# EAGLE design control_board (EAGLE 6.6.0)
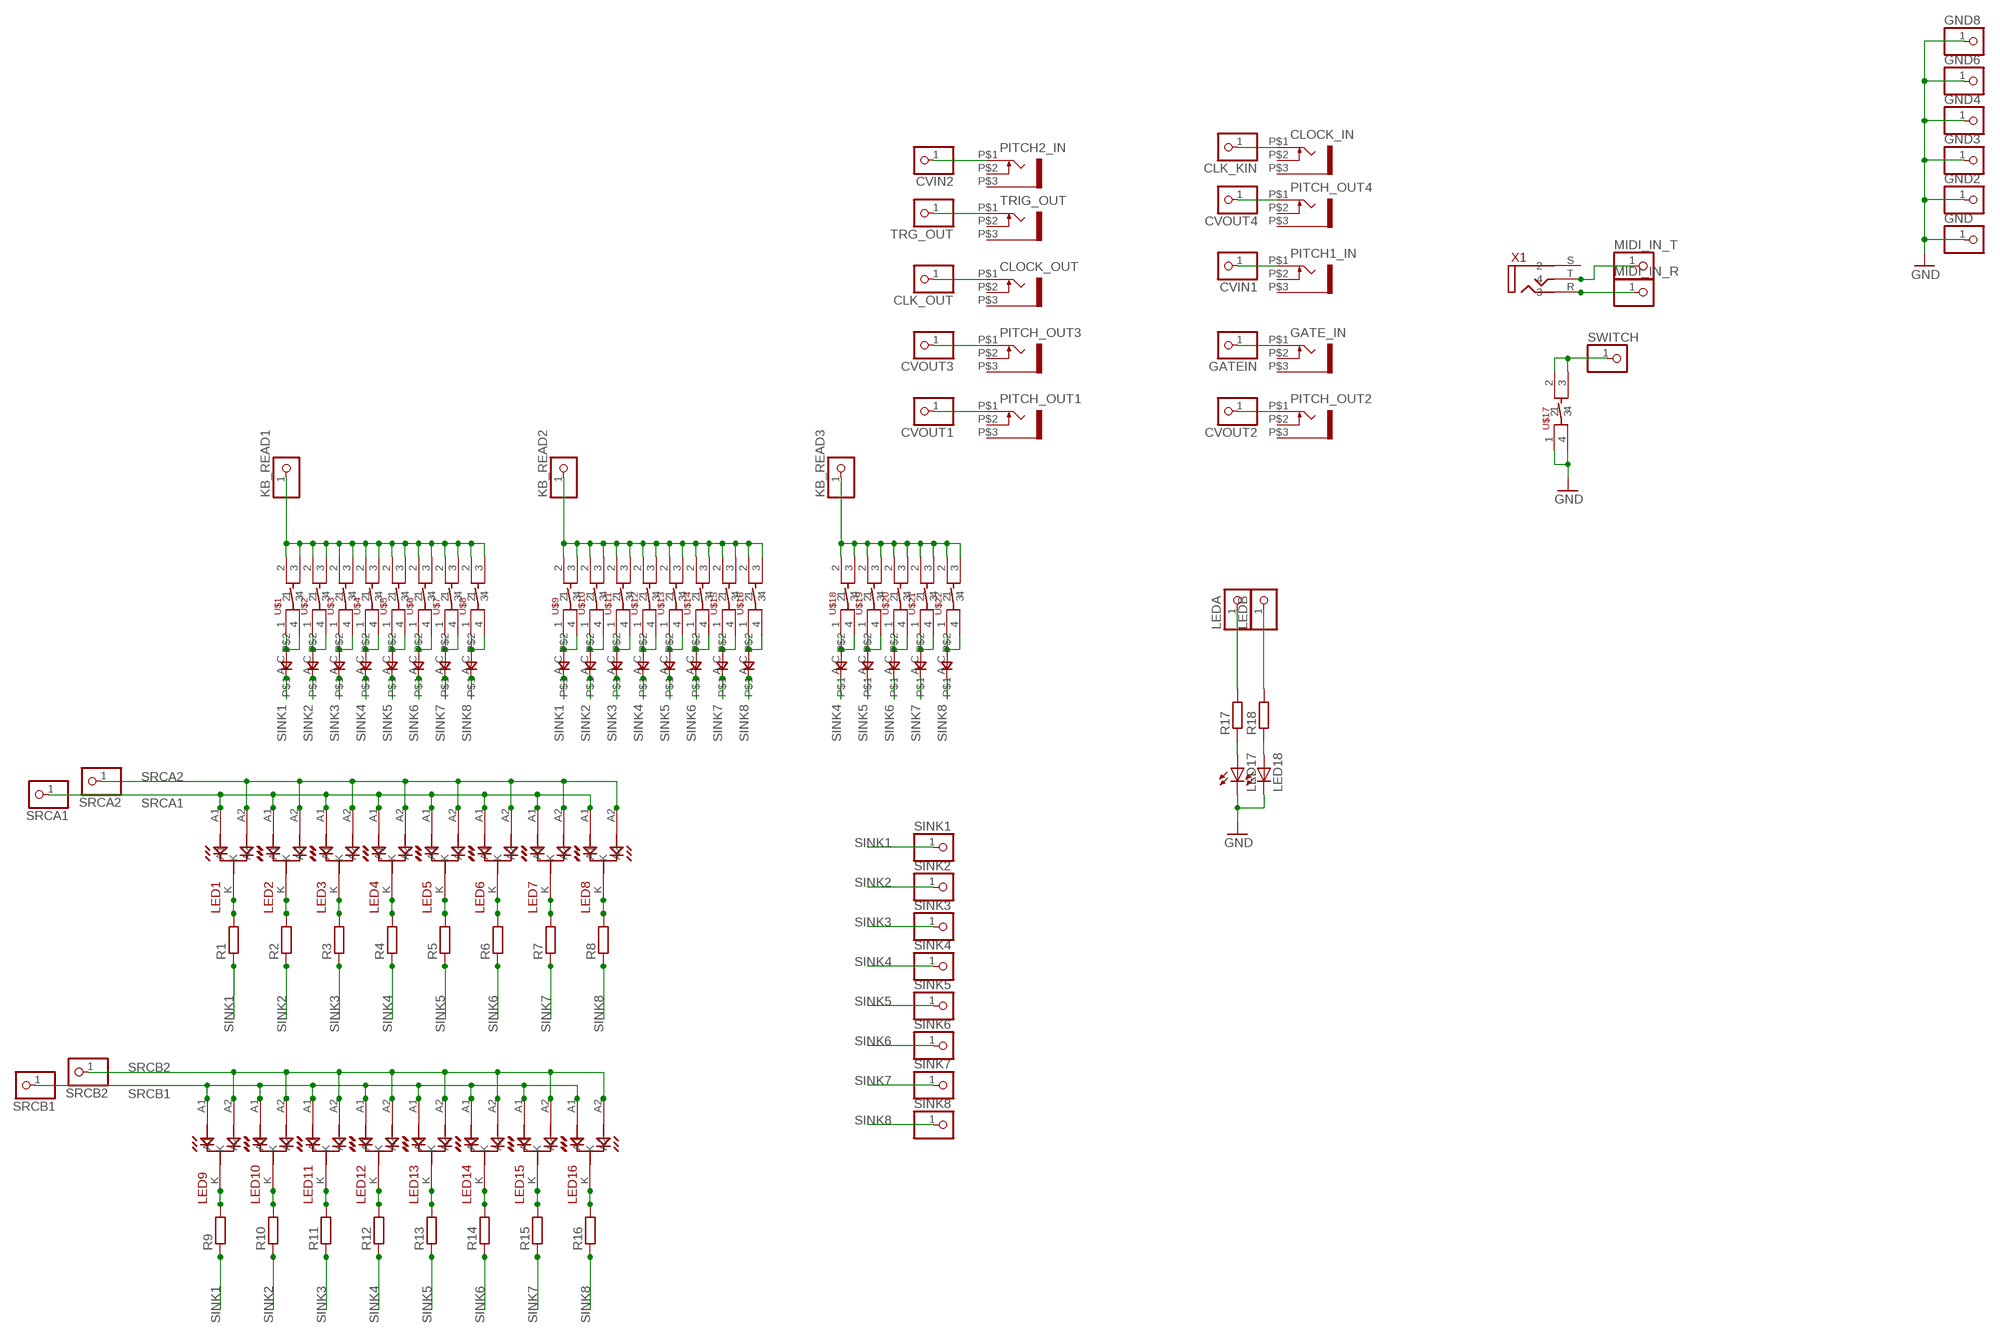
[diagram p0: schematic, sheet 1]

## Parts
CLK_KIN  PINHD-1X1  [1X01]
CLK_OUT  PINHD-1X1  [1X01]
CLOCK_IN  WQP-PJ301M-12_JACK  [WQP-PJ301M-12_JACK]
CLOCK_OUT  WQP-PJ301M-12_JACK  [WQP-PJ301M-12_JACK]
CVIN1  PINHD-1X1  [1X01]
CVIN2  PINHD-1X1  [1X01]
CVOUT1  PINHD-1X1  [1X01]
CVOUT2  PINHD-1X1  [1X01]
CVOUT3  PINHD-1X1  [1X01]
CVOUT4  PINHD-1X1  [1X01]
GATE_IN  WQP-PJ301M-12_JACK  [WQP-PJ301M-12_JACK]
GATEIN  PINHD-1X1  [1X01]
GND  PINHD-1X1  [1X01]
GND2  PINHD-1X1  [1X01]
GND3  PINHD-1X1  [1X01]
GND4  PINHD-1X1  [1X01]
GND6  PINHD-1X1  [1X01]
GND8  PINHD-1X1  [1X01]
KB_READ1  PINHD-1X1  [1X01]
KB_READ2  PINHD-1X1  [1X01]
KB_READ3  PINHD-1X1  [1X01]
LED1  BICOL_LED_CC  [BICOL_LED_CC]
LED2  BICOL_LED_CC  [BICOL_LED_CC]
LED3  BICOL_LED_CC  [BICOL_LED_CC]
LED4  BICOL_LED_CC  [BICOL_LED_CC]
LED5  BICOL_LED_CC  [BICOL_LED_CC]
LED6  BICOL_LED_CC  [BICOL_LED_CC]
LED7  BICOL_LED_CC  [BICOL_LED_CC]
LED8  BICOL_LED_CC  [BICOL_LED_CC]
LED9  BICOL_LED_CC  [BICOL_LED_CC]
LED10  BICOL_LED_CC  [BICOL_LED_CC]
LED11  BICOL_LED_CC  [BICOL_LED_CC]
LED12  BICOL_LED_CC  [BICOL_LED_CC]
LED13  BICOL_LED_CC  [BICOL_LED_CC]
LED14  BICOL_LED_CC  [BICOL_LED_CC]
LED15  BICOL_LED_CC  [BICOL_LED_CC]
LED16  BICOL_LED_CC  [BICOL_LED_CC]
LED17  LED3MM  [LED3MM]
LED18  LED3MM  [LED3MM]
LEDA  PINHD-1X1  [1X01]
LEDB  PINHD-1X1  [1X01]
MIDI_IN_R  PINHD-1X1  [1X01]
MIDI_IN_T  PINHD-1X1  [1X01]
PITCH1_IN  WQP-PJ301M-12_JACK  [WQP-PJ301M-12_JACK]
PITCH2_IN  WQP-PJ301M-12_JACK  [WQP-PJ301M-12_JACK]
PITCH_OUT1  WQP-PJ301M-12_JACK  [WQP-PJ301M-12_JACK]
PITCH_OUT2  WQP-PJ301M-12_JACK  [WQP-PJ301M-12_JACK]
PITCH_OUT3  WQP-PJ301M-12_JACK  [WQP-PJ301M-12_JACK]
PITCH_OUT4  WQP-PJ301M-12_JACK  [WQP-PJ301M-12_JACK]
R1  R-EU_R0805  [R0805]
R2  R-EU_R0805  [R0805]
R3  R-EU_R0805  [R0805]
R4  R-EU_R0805  [R0805]
R5  R-EU_R0805  [R0805]
R6  R-EU_R0805  [R0805]
R7  R-EU_R0805  [R0805]
R8  R-EU_R0805  [R0805]
R9  R-EU_R0805  [R0805]
R10  R-EU_R0805  [R0805]
R11  R-EU_R0805  [R0805]
R12  R-EU_R0805  [R0805]
R13  R-EU_R0805  [R0805]
R14  R-EU_R0805  [R0805]
R15  R-EU_R0805  [R0805]
R16  R-EU_R0805  [R0805]
R17  R-EU_R0805  [R0805]
R18  R-EU_R0805  [R0805]
SINK1  PINHD-1X1  [1X01]
SINK2  PINHD-1X1  [1X01]
SINK3  PINHD-1X1  [1X01]
SINK4  PINHD-1X1  [1X01]
SINK5  PINHD-1X1  [1X01]
SINK6  PINHD-1X1  [1X01]
SINK7  PINHD-1X1  [1X01]
SINK8  PINHD-1X1  [1X01]
SRCA1  PINHD-1X1  [1X01]
SRCA2  PINHD-1X1  [1X01]
SRCB1  PINHD-1X1  [1X01]
SRCB2  PINHD-1X1  [1X01]
SWITCH  PINHD-1X1  [1X01]
TRG_OUT  PINHD-1X1  [1X01]
TRIG_OUT  WQP-PJ301M-12_JACK  [WQP-PJ301M-12_JACK]
U$1  6MM_TACT  [6MMTACT]
U$2  6MM_TACT  [6MMTACT]
U$3  6MM_TACT  [6MMTACT]
U$4  6MM_TACT  [6MMTACT]
U$5  6MM_TACT  [6MMTACT]
U$6  6MM_TACT  [6MMTACT]
U$7  6MM_TACT  [6MMTACT]
U$8  6MM_TACT  [6MMTACT]
U$9  6MM_TACT  [6MMTACT]
U$10  6MM_TACT  [6MMTACT]
U$11  6MM_TACT  [6MMTACT]
U$12  6MM_TACT  [6MMTACT]
U$13  6MM_TACT  [6MMTACT]
U$14  6MM_TACT  [6MMTACT]
U$15  6MM_TACT  [6MMTACT]
U$16  6MM_TACT  [6MMTACT]
U$17  6MM_TACT  [6MMTACT]
U$18  6MM_TACT  [6MMTACT]
U$19  6MM_TACT  [6MMTACT]
U$20  6MM_TACT  [6MMTACT]
U$21  6MM_TACT  [6MMTACT]
U$22  6MM_TACT  [6MMTACT]
U$23  0805DIODE  [0805DIODE]
U$24  0805DIODE  [0805DIODE]
U$25  0805DIODE  [0805DIODE]
U$26  0805DIODE  [0805DIODE]
U$27  0805DIODE  [0805DIODE]
U$28  0805DIODE  [0805DIODE]
U$29  0805DIODE  [0805DIODE]
U$30  0805DIODE  [0805DIODE]
U$31  0805DIODE  [0805DIODE]
U$32  0805DIODE  [0805DIODE]
U$33  0805DIODE  [0805DIODE]
U$34  0805DIODE  [0805DIODE]
U$35  0805DIODE  [0805DIODE]
U$36  0805DIODE  [0805DIODE]
U$37  0805DIODE  [0805DIODE]
U$38  0805DIODE  [0805DIODE]
U$39  0805DIODE  [0805DIODE]
U$40  0805DIODE  [0805DIODE]
U$41  0805DIODE  [0805DIODE]
U$42  0805DIODE  [0805DIODE]
U$43  0805DIODE  [0805DIODE]
X1  VERTICAL_3_5MM_SOCKETTHONK  [PJ301CM]

## Nets
GND: GND2.1 GND3.1 GND4.1 GND6.1 GND8.1 GND.1 LED17.K(C) LED18.K(C) U$17.1 U$17.4
KB_READ: KB_READ2.1 U$9.2 U$9.3 U$10.2 U$10.3 U$11.2 U$11.3 U$12.2 U$12.3 U$13.2 U$13.3 U$14.2 U$14.3 U$15.2 U$15.3 U$16.2 U$16.3
LED2: LED2.K R2.2
LEDA: LEDA.1 R17.2
N$1: U$9.1 U$9.4 U$31.C
N$2: KB_READ1.1 U$1.2 U$1.3 U$2.2 U$2.3 U$3.2 U$3.3 U$4.2 U$4.3 U$5.2 U$5.3 U$6.2 U$6.3 U$7.2 U$7.3 U$8.2 U$8.3
N$3: U$10.1 U$10.4 U$32.C
N$4: U$1.1 U$1.4 U$23.C
N$5: U$2.1 U$2.4 U$24.C
N$6: U$3.1 U$3.4 U$25.C
N$7: U$4.1 U$4.4 U$26.C
N$8: U$5.1 U$5.4 U$27.C
N$9: U$18.1 U$18.4 U$39.C
N$10: U$19.1 U$19.4 U$40.C
N$11: U$20.1 U$20.4 U$41.C
N$12: KB_READ3.1 U$18.2 U$18.3 U$19.2 U$19.3 U$20.2 U$20.3 U$21.2 U$21.3 U$22.2 U$22.3
N$13: U$6.1 U$6.4 U$28.C
N$14: U$11.1 U$11.4 U$33.C
N$15: U$12.1 U$12.4 U$34.C
N$16: U$13.1 U$13.4 U$35.C
N$17: LED1.K R1.2
N$18: U$14.1 U$14.4 U$36.C
N$19: LED17.A R17.1
N$20: LED3.K R3.2
N$21: LED4.K R4.2
N$22: LED5.K R5.2
N$23: LED6.K R6.2
N$24: LED7.K R7.2
N$25: LED8.K R8.2
N$26: U$16.1 U$16.4 U$38.C
N$27: LED9.K R9.2
N$28: U$15.1 U$15.4 U$37.C
N$29: LED10.K R10.2
N$30: LED11.K R11.2
N$31: LED12.K R12.2
N$32: LED13.K R13.2
N$33: LED14.K R14.2
N$34: LED15.K R15.2
N$35: LED16.K R16.2
N$36: LED18.A R18.1
N$38: MIDI_IN_R.1 X1.R
N$40: U$8.1 U$8.4 U$30.C
N$42: U$7.1 U$7.4 U$29.C
N$48: LEDB.1 R18.2
N$71: U$22.1 U$22.4 U$43.C
N$72: U$21.1 U$21.4 U$42.C
N$76: SWITCH.1 U$17.2 U$17.3
N$77: MIDI_IN_T.1 X1.T
N$78: CVIN2.1 PITCH2_IN.P$1
N$79: TRG_OUT.1 TRIG_OUT.P$1
N$80: CLK_OUT.1 CLOCK_OUT.P$1
N$81: CVOUT3.1 PITCH_OUT3.P$1
N$82: CVOUT1.1 PITCH_OUT1.P$1
N$83: CLK_KIN.1 CLOCK_IN.P$1
N$84: CVOUT4.1 PITCH_OUT4.P$1
N$85: CVIN1.1 PITCH1_IN.P$1
N$86: GATE_IN.P$1 GATEIN.1
N$87: CVOUT2.1 PITCH_OUT2.P$1
SINK1: R1.1 R9.1 SINK1.1 U$23.A U$31.A
SINK2: R2.1 R10.1 SINK2.1 U$24.A U$32.A
SINK3: R3.1 R11.1 SINK3.1 U$25.A U$33.A
SINK4: R4.1 R12.1 SINK4.1 U$26.A U$34.A U$39.A
SINK5: R5.1 R13.1 SINK5.1 U$27.A U$35.A U$40.A
SINK6: R6.1 R14.1 SINK6.1 U$28.A U$36.A U$41.A
SINK7: R7.1 R15.1 SINK7.1 U$29.A U$37.A U$42.A
SINK8: R8.1 R16.1 SINK8.1 U$30.A U$38.A U$43.A
SRCA1: LED1.A1 LED2.A1 LED3.A1 LED4.A1 LED5.A1 LED6.A1 LED7.A1 LED8.A1 SRCA1.1
SRCA2: LED1.A2 LED2.A2 LED3.A2 LED4.A2 LED5.A2 LED6.A2 LED7.A2 LED8.A2 SRCA2.1
SRCB1: LED9.A1 LED10.A1 LED11.A1 LED12.A1 LED13.A1 LED14.A1 LED15.A1 LED16.A1 SRCB1.1
SRCB2: LED9.A2 LED10.A2 LED11.A2 LED12.A2 LED13.A2 LED14.A2 LED15.A2 LED16.A2 SRCB2.1
Unconnected: CLOCK_IN.P$2 CLOCK_IN.P$3 CLOCK_OUT.P$2 CLOCK_OUT.P$3 GATE_IN.P$2 GATE_IN.P$3 PITCH1_IN.P$2 PITCH1_IN.P$3 PITCH2_IN.P$2 PITCH2_IN.P$3 PITCH_OUT1.P$2 PITCH_OUT1.P$3 PITCH_OUT2.P$2 PITCH_OUT2.P$3 PITCH_OUT3.P$2 PITCH_OUT3.P$3 PITCH_OUT4.P$2 PITCH_OUT4.P$3 TRIG_OUT.P$2 TRIG_OUT.P$3 X1.S

## Library data of the parts
CLK_KIN CLK_OUT CVIN1 CVIN2 CVOUT1-CVOUT4 GATEIN GND GND2-GND4 GND6 GND8 KB_READ1-KB_READ3 LEDA LEDB MIDI_IN_R MIDI_IN_T SINK1-SINK8 SRCA1 SRCA2 SRCB1 SRCB2 SWITCH TRG_OUT = pinhead:PINHD-1X1: PIN HEADER
CLOCK_IN CLOCK_OUT GATE_IN PITCH1_IN PITCH2_IN PITCH_OUT1-PITCH_OUT4 TRIG_OUT = thonkiconn:WQP-PJ301M-12_JACK
LED1-LED16 = jason_eagle6:BICOL_LED_CC
LED17 LED18 = SparkFun:LED: LEDs Standard schematic elements and footprints for 5mm, 3mm, 1206, and 0603 sized LEDs. 5mm - Spark Fun Electronics SKU : COM-00529 (and others)
R1-R18 = rcl:R-EU_: RESISTOR, European symbol
U$1-U$22 = jason_eagle6:6MM_TACT
U$23-U$43 = jasons_stuff:0805DIODE
X1 = jason_eagle6:VERTICAL_3_5MM_SOCKET

## Board
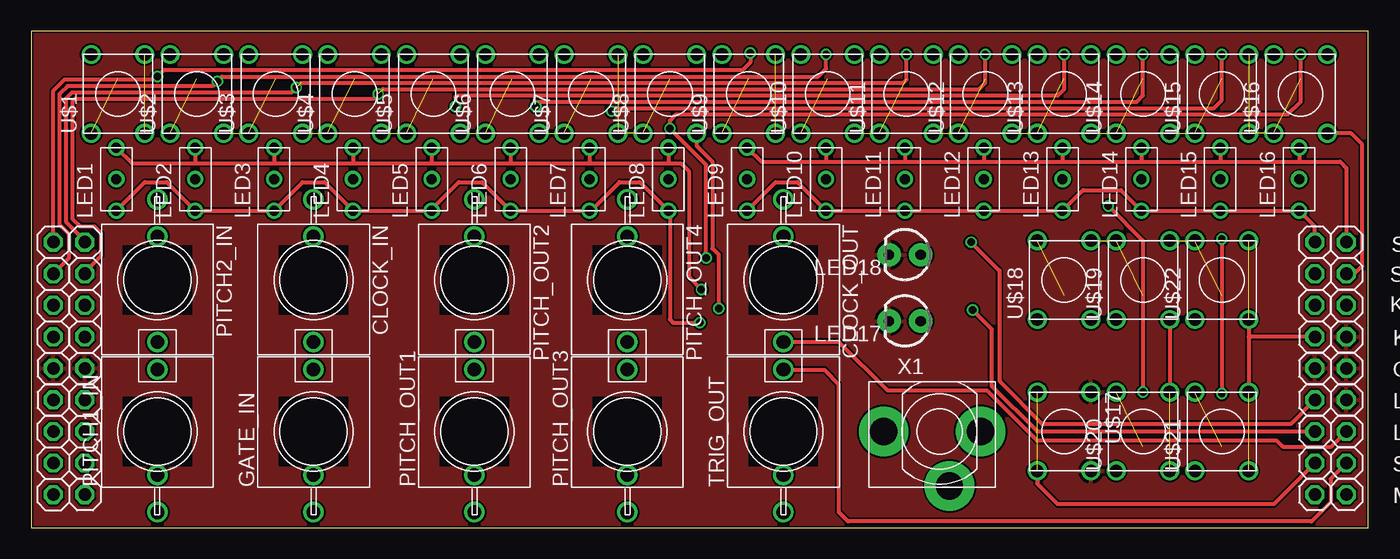
[diagram p1: board, top side]
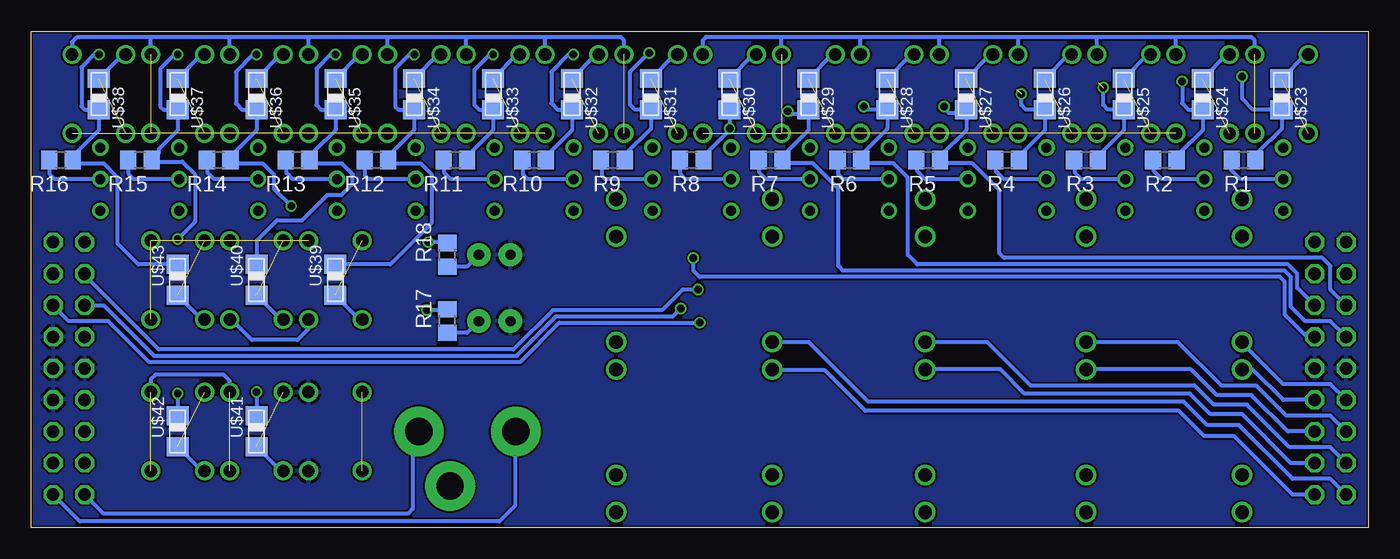
[diagram p2: board, bottom side, seen from below]

Size 107.71 x 39.98 mm. Coordinates in mm from the lower left corner, seen from the top.
Outline: 107.71,0 107.71,39.98 0,39.98 0,0 107.71,0
Copper layers (1*16): Top 0.035mm / dielectric 1.5mm / Bottom 0.035mm
Design rules "hackvana": minimum track width 6mil, minimum drill 0.3mm, track to track 6mil, track to pad 9mil, pad to pad 6mil, via to via 6mil, smd to smd 0mil, copper to edge 6mil, drill to drill 6mil, minimum pad ring 10mil, minimum via ring 6mil, stop-mask expansion 2mil, vias tented up to drill 100mil, thermal gap 10mil

### Footprints (pad centres in the part's own frame; a part is rotated, then mirrored left to right if it is on the bottom)
1X01 = drill 1.016 octagon: 1 0,0
WQP-PJ301M-12_JACK = drill 1.1: P$1 0,5; P$2 0,-3.5; P$3 0,-6.5
BICOL_LED_CC = drill 0.8: A1 0,2.54; A2 0,-2.54; K 0,0
LED3MM = drill 0.813 pad 1.88: A -1.27,0; K 1.27,0
R0805 = smd 1.3 x 1.5: 1 -0.95,0; 2 0.95,0
6MMTACT = drill 1.016: 1 -3.175,2.159; 2 -3.175,-2.159; 3 3.175,-2.159; 4 3.175,2.159
0805DIODE = smd 1.524 x 1.778: A -1.262,-0.005; C 1.238,-0.005
PJ301CM = drill 2.2 pad 4: R 0,3.3; S 4.4,0.8; T 0,-4.5

### Placement (x,y rotation side)
CLK_KIN  1.8,7.75 90 top
CLK_OUT  105.94,7.75 0 top
CLOCK_IN  22.75,19.94 180 top
CLOCK_OUT  60.6,19.94 180 top
CVIN1  4.34,10.29 90 top
CVIN2  1.8,10.29 0 top
CVOUT1  4.34,5.21 0 top
CVOUT2  1.8,5.21 90 top
CVOUT3  4.34,2.67 0 top
CVOUT4  1.8,2.67 90 top
GATE_IN  22.75,7.75 0 top
GATEIN  4.34,7.75 90 top
GND  105.94,10.29 0 top
GND2  4.34,12.83 0 top
GND3  1.8,12.83 0 top
GND4  103.4,12.83 0 top
GND6  105.94,12.83 0 top
GND8  105.94,15.37 0 top
KB_READ1  103.4,17.91 90 top
KB_READ2  105.94,20.45 0 top
KB_READ3  103.4,15.37 0 top
LED1  6.88,28.07 0 top
LED2  13.23,28.07 0 top
LED3  19.58,28.07 0 top
LED4  25.93,28.07 0 top
LED5  32.28,28.07 0 top
LED6  38.63,28.07 0 top
LED7  44.98,28.07 0 top
LED8  51.33,28.07 0 top
LED9  57.68,28.07 0 top
LED10  64.03,28.07 0 top
LED11  70.38,28.07 0 top
LED12  76.73,28.07 0 top
LED13  83.08,28.07 0 top
LED14  89.43,28.07 0 top
LED15  95.78,28.07 0 top
LED16  102.13,28.07 0 top
LED17  70.38,16.64 180 top
LED18  70.38,21.97 180 top
LEDA  103.4,7.75 0 top
LEDB  103.4,10.29 0 top
MIDI_IN_R  103.4,2.67 0 top
MIDI_IN_T  105.94,2.67 0 top
PITCH1_IN  10.18,7.75 0 top
PITCH2_IN  10.18,19.94 180 top
PITCH_OUT1  35.71,7.75 0 top
PITCH_OUT2  35.71,19.94 180 top
PITCH_OUT3  48.02,7.75 0 top
PITCH_OUT4  48.02,19.94 180 top
R1  10.05,29.59 180 bottom
R2  16.4,29.59 180 bottom
R3  22.75,29.59 180 bottom
R4  29.1,29.59 180 bottom
R5  35.45,29.59 180 bottom
R6  41.8,29.59 180 bottom
R7  48.15,29.59 180 bottom
R8  54.5,29.59 180 bottom
R9  60.85,29.59 180 bottom
R10  67.2,29.59 180 bottom
R11  73.55,29.59 180 bottom
R12  79.9,29.59 180 bottom
R13  86.25,29.59 180 bottom
R14  92.6,29.59 180 bottom
R15  98.95,29.59 180 bottom
R16  105.3,29.59 180 bottom
R17  74.19,16.64 90 bottom
R18  74.19,21.97 90 bottom
SINK1  1.8,22.99 90 top
SINK2  1.8,20.45 90 top
SINK3  4.34,22.99 90 top
SINK4  4.34,20.45 90 top
SINK5  1.8,17.91 90 top
SINK6  4.34,17.91 90 top
SINK7  1.8,15.37 90 top
SINK8  4.34,15.37 90 top
SRCA1  103.4,20.45 90 top
SRCA2  105.94,17.91 90 top
SRCB1  105.94,22.99 90 top
SRCB2  103.4,22.99 90 top
SWITCH  103.4,5.21 0 top
TRG_OUT  105.94,5.21 0 top
TRIG_OUT  60.6,7.75 0 top
U$1  7,34.92 90 top
U$2  13.35,34.92 90 top
U$3  19.7,34.92 90 top
U$4  26.05,34.92 90 top
U$5  32.4,34.92 90 top
U$6  38.75,34.92 90 top
U$7  45.1,34.92 90 top
U$8  51.45,34.92 90 top
U$9  57.8,34.92 90 top
U$10  64.15,34.92 90 top
U$11  70.5,34.92 90 top
U$12  76.85,34.92 90 top
U$13  83.2,34.92 90 top
U$14  89.55,34.92 90 top
U$15  95.9,34.92 90 top
U$16  102.25,34.92 90 top
U$17  83.2,7.75 270 top
U$18  83.2,19.94 90 top
U$19  89.55,19.94 90 top
U$20  89.55,7.75 90 top
U$21  95.9,7.75 90 top
U$22  95.9,19.94 90 top
U$23  7,34.92 90 bottom
U$24  13.35,34.92 90 bottom
U$25  19.7,34.92 90 bottom
U$26  26.05,34.92 90 bottom
U$27  32.4,34.92 90 bottom
U$28  38.75,34.92 90 bottom
U$29  45.1,34.92 90 bottom
U$30  51.45,34.92 90 bottom
U$31  57.8,34.92 90 bottom
U$32  64.15,34.92 90 bottom
U$33  70.5,34.92 90 bottom
U$34  76.85,34.92 90 bottom
U$35  83.2,34.92 90 bottom
U$36  89.55,34.92 90 bottom
U$37  95.9,34.92 90 bottom
U$38  102.25,34.92 90 bottom
U$39  83.2,19.94 270 bottom
U$40  89.55,19.94 270 bottom
U$41  89.55,7.75 270 bottom
U$42  95.9,7.75 270 bottom
U$43  95.9,19.94 270 bottom
X1  73.17,7.75 270 top

### Tracks (layer width: path | path; a pad name or v marks a point on that pad's centre or on a via)
GND
  pour Bottom: -2.01,43.31 -2.01,-4.95 111.02,-4.95 111.02,44.58 -2.01,44.58
  pour Top: -2.01,45.85 -2.01,0.13 108.48,0.13 108.48,45.85
KB_READ  (8 unrouted)
  Top 0.305: KB_READ2.1 106.57,20.45 107.21,21.08 107.21,30.86 106.32,31.75 U$16.2
  Bottom 0.305: U$9.3 59.96,39.24 60.22,39.5 66.44,39.5 | 66.44,39.5 72.54,39.5 | 72.54,39.5 78.89,39.5 | 78.89,39.5 85.36,39.5 | 85.36,39.5 91.84,39.5 | 91.84,39.5 98.19,39.5 | 98.19,39.5 104.03,39.5 104.41,39.12 U$16.3 | U$10.3 66.31,39.37 66.44,39.5 | U$11.3 72.66,39.37 72.54,39.5 | U$12.3 79.01,39.37 78.89,39.5 | U$13.3 85.36,39.5 | U$14.3 91.71,39.37 91.84,39.5 | U$15.3 98.06,39.37 98.19,39.5
LED2
  Bottom 0.305: LED2.K 16.66,28.07 17.29,28.7 17.29,29.53 R2.2
LEDA  (via drill 0.6)
  Top 0.305: v75.84,17.53 77.36,16 77.36,11.43 81.04,7.75 LEDA.1
  Bottom 0.305: R17.2 74.25,17.53 v75.84,17.53
N$1  (1 unrouted)
  Bottom 0.305: U$9.4 55.86,38.1 U$31.C
N$2  (via drill 0.6)  (8 unrouted)
  Top 0.305: U$8.2 53.61,30.73 54.88,29.46 54.88,22.48 55.39,21.97 v55.39,17.65
  Bottom 0.305: U$1.3 9.16,39.24 9.42,39.5 15.51,39.5 | 15.51,39.5 21.86,39.5 | 21.86,39.5 28.21,39.5 | 28.21,39.5 34.69,39.5 | 34.69,39.5 41.04,39.5 | 41.04,39.5 47.26,39.5 | 47.26,39.5 53.36,39.5 53.61,39.24 U$8.3 | U$2.3 15.51,39.5 | U$3.3 21.86,39.5 | U$4.3 28.21,39.5 | U$5.3 34.56,39.37 34.69,39.5 | U$6.3 40.91,39.37 41.04,39.5 | U$7.3 47.26,39.5 | KB_READ1.1 101.87,17.91 97.81,13.84 68.6,13.84 65.42,17.02 56.03,17.02 v55.39,17.65
N$3  (1 unrouted)
  Bottom 0.305: U$10.4 62.21,38.1 U$32.C
N$4  (1 unrouted)
  Bottom 0.305: U$1.4 5.06,38.1 U$23.C
N$5  (1 unrouted)
  Bottom 0.305: U$2.4 11.41,38.1 U$24.C
N$6  (1 unrouted)
  Bottom 0.305: U$3.4 17.76,38.1 U$25.C
N$7  (1 unrouted)
  Bottom 0.305: U$4.4 24.11,38.1 U$26.C
N$8  (1 unrouted)
  Bottom 0.305: U$5.4 30.46,38.1 U$27.C
N$9  (1 unrouted)
  Bottom 0.305: U$39.C 81.27,16.76 U$18.1
N$10  (1 unrouted)
  Bottom 0.305: U$40.C 87.62,16.76 U$19.1
N$11  (1 unrouted)
  Bottom 0.305: U$41.C 87.62,4.57 U$20.1
N$12  (5 unrouted)
  Top 0.305: U$19.2 U$20.3 | U$22.2 98.06,15.37 | 98.06,15.37 U$21.3 | KB_READ3.1 98.06,15.37
  Bottom 0.305: 91.71,11.56 U$20.3 91.71,11.81 92.22,12.32 97.68,12.32 98.06,11.94 U$21.3 | U$18.2 85.36,16 86.25,15.11 89.93,15.11 91.59,16.76 U$19.2
N$13  (1 unrouted)
  Bottom 0.305: U$6.4 36.81,38.1 U$28.C
N$14  (1 unrouted)
  Bottom 0.305: U$11.4 68.56,38.1 U$33.C
N$15  (1 unrouted)
  Bottom 0.305: U$12.4 74.91,38.1 U$34.C
N$16  (1 unrouted)
  Bottom 0.305: U$13.4 81.26,38.1 U$35.C
N$17
  Bottom 0.305: LED1.K 10.31,28.07 11.07,28.83 11.07,29.53 R1.2
N$18  (1 unrouted)
  Bottom 0.305: U$14.4 87.61,38.1 U$36.C
N$19
  Bottom 0.305: LED17.A 72.6,15.69 R17.1
N$20
  Bottom 0.305: LED3.K 23.13,28.07 23.64,28.58 23.64,29.53 R3.2
N$21
  Bottom 0.305: LED4.K 29.36,28.07 29.99,28.7 29.99,29.53 R4.2
N$22
  Bottom 0.305: LED5.K 35.71,28.07 36.34,28.7 36.34,29.53 R5.2
N$23
  Bottom 0.305: LED6.K 42.31,28.07 42.69,28.45 42.69,29.53 R6.2
N$24
  Bottom 0.305: LED7.K 48.53,28.07 49.04,28.58 49.04,29.53 R7.2
N$25
  Bottom 0.305: LED8.K 55.01,28.07 55.39,28.45 55.39,29.53 R8.2
N$26  (1 unrouted)
  Bottom 0.305: U$16.4 100.31,38.1 U$38.C
N$27
  Bottom 0.305: LED9.K 61.49,28.07 61.74,28.32 61.74,29.53 R9.2
N$28  (1 unrouted)
  Bottom 0.305: U$15.4 93.96,38.1 U$37.C
N$29
  Bottom 0.305: LED10.K 67.71,28.07 68.09,28.45 68.09,29.53 R10.2
N$30
  Bottom 0.305: LED11.K 73.93,28.07 74.44,28.58 74.44,29.53 R11.2
N$31
  Bottom 0.305: LED12.K 80.54,28.07 80.79,28.32 80.79,29.53 R12.2
N$32
  Bottom 0.305: LED13.K 86.63,28.07 87.14,28.58 87.14,29.53 R13.2
N$33
  Bottom 0.305: LED14.K 92.98,28.07 93.49,28.58 93.49,29.53 R14.2
N$34
  Bottom 0.305: LED15.K 99.46,28.07 99.84,28.45 99.84,29.53 R15.2
N$35
  Bottom 0.305: LED16.K 105.81,28.07 106.19,28.45 106.19,29.53 R16.2
N$36
  Bottom 0.305: LED18.A 72.6,21.02 R18.1
N$38
  Bottom 0.305: X1.R 76.98,7.24 76.98,1.52 77.36,1.14 101.87,1.14 MIDI_IN_R.1
N$40  (1 unrouted)
  Bottom 0.305: U$8.4 49.51,38.1 U$30.C
N$42  (1 unrouted)
  Bottom 0.305: U$7.4 43.16,38.1 U$29.C
N$48  (via drill 0.6)
  Top 0.305: v75.71,22.99 78,20.7 78,11.81 81.43,8.38 101.49,8.38 LEDB.1
  Bottom 0.305: R18.2 74.25,22.99 v75.71,22.99
N$71  (1 unrouted)
  Bottom 0.305: U$43.C 93.97,16.76 U$22.1
N$72  (1 unrouted)
  Bottom 0.305: U$42.C 93.97,4.57 U$21.1
N$76  (1 unrouted)
  Top 0.305: SWITCH.1 100.09,1.91 82.7,1.91 81.04,3.56 U$17.3
N$77
  Bottom 0.305: X1.T 68.73,7.69 68.73,1.78 70,0.51 103.78,0.51 MIDI_IN_T.1
N$78
  Bottom 0.305: CVIN2.1 3.07,11.56 6.88,11.56 10.18,14.86 PITCH2_IN.P$1
N$79
  Top 0.305: TRIG_OUT.P$1 60.64,12.7 63.9,12.7 65.04,11.56 65.04,1.27 65.8,0.51 103.14,0.51 104.67,2.03 104.67,3.94 TRG_OUT.1
N$80
  Top 0.305: CLOCK_OUT.P$1 60.64,14.99 65.04,14.99 68.98,11.05 76.98,11.05 81.04,6.99 100.35,6.99 100.86,6.48 104.67,6.48 CLK_OUT.1
N$81
  Bottom 0.305: CVOUT3.1 6.11,2.67 10.81,7.37 13.23,7.37 15.26,9.4 40.53,9.4 43.83,12.7 47.98,12.7 PITCH_OUT3.P$1
N$82
  Bottom 0.305: CVOUT1.1 6.24,5.21 10.18,9.14 12.72,9.14 14.37,10.8 27.7,10.8 29.66,12.75 PITCH_OUT1.P$1
N$83
  Bottom 0.305: 22.75,14.73 CLOCK_IN.P$1 15.34,14.94 11.83,11.43 9.04,11.43 6.62,9.02 3.07,9.02 CLK_KIN.1
N$84
  Bottom 0.305: CVOUT4.1 3.07,3.94 6.11,3.94 10.43,8.26 12.97,8.26 14.88,10.16 40.28,10.16 45.06,14.94 PITCH_OUT4.P$1
N$85
  Bottom 0.305: CVIN1.1 6.88,10.29 9.34,12.75 PITCH1_IN.P$1
N$86
  Bottom 0.305: GATEIN.1 6.5,7.75 9.42,10.67 12.21,10.67 14.29,12.75 GATE_IN.P$1
N$87
  Bottom 0.305: CVOUT2.1 3.07,6.48 6.37,6.48 9.8,9.91 12.46,9.91 13.99,11.43 27.2,11.43 30.71,14.94 PITCH_OUT2.P$1
SINK1  (via drill 0.6)
  Top 0.305: v57.93,38.23 57.93,37.47 57.3,36.83 10.69,36.83 v10.18,36.32 9.92,36.07 2.69,36.07 1.8,35.18 SINK1.1
  Bottom 0.305: U$23.A 7,32.14 8.91,30.23 8.91,29.78 R1.1 | R9.1 59.9,30.03 57.8,32.14 U$31.A 59.08,33.66 59.45,34.04 59.45,36.7 v57.93,38.23 | 7.01,33.66 U$23.A | U$23.A 9.3,33.66 10.18,34.54 v10.18,36.32
SINK2  (via drill 0.6)
  Top 0.305: v64.03,38.1 64.03,36.96 63.39,36.32 15.39,36.32 v15,35.94 14.62,35.56 2.94,35.56 2.3,34.92 2.3,24.38 3.07,23.62 3.07,21.72 SINK2.1
  Bottom 0.305: R2.1 15.26,29.78 15.26,30.1 13.35,32.01 U$24.A 13.36,33.66 14.5,33.66 15,34.16 v15,35.94 | R10.1 66.25,29.91 64.15,32.01 U$32.A 64.16,33.66 65.3,33.66 65.8,34.16 65.8,36.7 64.41,38.1 v64.03,38.1
SINK3  (via drill 0.6)  (1 unrouted)
  Top 0.305: v70.5,38.1 70.5,36.07 70.25,35.81 21.74,35.81 20.97,35.05 3.32,35.05 2.81,34.54 2.81,24.64 4.34,23.11 SINK3.1
  Bottom 0.305: R3.1 21.48,29.91 21.48,30.23 19.7,32.01 U$25.A 20.98,33.66 21.35,34.04 v21.35,35.43 | R11.1 72.41,29.78 72.41,30.1 70.5,32.01 U$33.A 70.51,33.66 71.65,33.66 72.03,34.04 72.03,36.83 70.76,38.1 v70.5,38.1
SINK4  (via drill 0.6)  (1 unrouted)
  Top 0.305: v76.85,38.1 76.85,35.81 76.35,35.31 28.34,35.31 27.58,34.54 3.57,34.54 3.32,34.29 3.32,24.89 3.96,24.26 5.1,24.26 5.61,23.75 5.61,21.84 4.34,20.57 SINK4.1
  Bottom 0.305: R4.1 28.15,29.91 26.05,32.01 U$26.A 27.59,33.66 27.96,34.04 v27.96,34.92 | v76.85,38.1 77.23,38.1 78.38,36.96 78.38,33.91 78.12,33.66 76.86,33.66 U$34.A 76.85,32.01 78.76,30.1 78.76,29.78 R12.1 78.7,29.34 76.35,29.34 75.46,28.45 75.46,24.51 78.77,21.2 U$39.A
SINK5  (via drill 0.6)
  Top 0.305: v83.2,38.1 83.2,35.31 82.7,34.8 34.31,34.8 34.18,34.67 v34.18,33.91
  Bottom 0.305: U$27.A 32.4,33.15 | 32.4,33.15 32.4,32.01 34.5,29.91 R5.1 34.25,29.34 31.9,29.34 29.74,27.18 29.74,22.1 29.36,21.72 3.7,21.72 3.07,21.08 3.07,19.18 SINK5.1 | U$35.A 83.2,33.15 | 83.2,33.15 83.2,32.01 84.85,30.35 84.85,30.04 R13.1 85.05,29.34 82.7,29.34 81.81,28.45 81.81,27.69 82.7,26.8 83.84,26.8 85.87,24.77 87.9,24.77 89.56,23.11 U$40.A | v83.2,38.1 83.58,38.1 84.73,36.96 84.73,34.04 84.35,33.66 83.71,33.66 83.2,33.15 | 32.4,33.15 32.65,33.4 33.8,33.4 34.18,33.78 v34.18,33.91
SINK6  (via drill 0.6)
  Top 0.305: v40.66,33.91 40.66,34.16 40.79,34.29 89.05,34.29 89.55,34.8 v89.55,38.1 | v89.55,10.92 89.55,23.11 v86.76,25.91
  Bottom 0.305: U$36.A 89.55,33.15 | 89.55,33.15 89.55,32.01 91.33,30.23 91.33,29.91 R14.1 91.4,29.34 89.05,29.34 88.16,28.45 88.16,27.31 v86.76,25.91 | v40.66,33.91 40.41,33.66 U$28.A 38.75,32.14 40.85,30.03 R6.1 40.6,29.34 38.25,29.34 37.1,28.19 37.1,21.97 36.34,21.21 6.5,21.21 5.73,20.45 5.73,19.3 SINK6.1 | v89.55,38.1 89.81,38.1 91.2,36.7 91.2,34.16 90.7,33.66 90.06,33.66 89.55,33.15 | v89.55,10.92 v89.56,10.92 U$41.A
SINK7  (via drill 0.6)
  Top 0.305: v46.75,33.53 47.01,33.78 95.27,33.78 95.9,34.42 v95.9,38.1 | v95.9,23.24 v95.9,10.8
  Bottom 0.305: v46.75,33.53 46.5,33.27 45.23,33.27 45.1,33.41 U$29.A 45.1,32.01 47.2,29.91 R7.1 46.95,29.34 44.72,29.34 42.69,27.31 42.69,21.08 42.31,20.7 6.75,20.7 6.24,20.19 6.24,17.78 5.1,16.64 3.07,16.64 SINK7.1 | v95.9,38.1 96.16,38.1 97.3,36.96 97.3,33.91 97.05,33.66 95.91,33.66 U$37.A 95.9,32.01 97.43,30.48 97.43,30.17 R15.1 97.87,29.46 95.52,29.46 94.51,28.45 94.51,24.64 v95.9,23.24 | v95.9,10.8 v95.91,10.79 U$42.A
SINK8  (via drill 0.6)
  Top 0.305: v102.25,38.1 102.25,34.29 101.24,33.27 51.96,33.27 51.45,32.77 v51.45,32.13 54.37,29.21 v54.37,21.72
  Bottom 0.305: R8.1 53.55,29.91 51.45,32.01 U$30.A v51.45,32.14 v51.45,32.13 | v102.25,38.1 102.63,38.1 103.65,37.08 103.65,33.91 103.4,33.66 102.26,33.66 U$38.A 102.25,32.01 104.35,29.91 R16.1 104.1,29.34 101.87,29.34 100.73,28.19 100.73,22.86 99.08,21.21 95.92,21.21 U$43.A | SINK8.1 4.97,15.37 6.75,17.15 6.75,19.81 7.13,20.19 53.87,20.19 54.37,20.7 v54.37,21.72
SRCA1  (via drill 0.6)
  Top 0.305: LED1.A1 8.15,29.34 13.23,29.34 | 13.23,29.34 19.58,29.34 | 19.58,29.34 25.93,29.34 | 25.93,29.34 32.28,29.34 | 32.28,29.34 38.63,29.34 | 38.63,29.34 44.98,29.34 | 44.98,29.34 51.33,29.34 | 51.33,29.34 52.34,29.34 52.98,28.7 52.98,20.19 v53.99,19.18 | LED7.A1 44.98,29.34 | LED6.A1 38.63,29.34 | LED5.A1 32.28,29.34 | LED4.A1 25.93,29.34 | LED3.A1 19.58,29.34 | LED2.A1 13.23,29.34 | LED8.A1 51.33,29.34
  Bottom 0.305: v53.99,19.18 55.26,19.18 56.91,17.53 65.68,17.53 68.85,14.35 97.43,14.35 103.4,20.32 SRCA1.1
SRCA2  (via drill 0.6)
  Top 0.305: LED1.A2 9.16,27.81 10.94,27.81 LED2.A2 LED3.A2 21.86,27.81 23.64,27.81 LED4.A2 LED5.A2 32.28,25.65 34.44,27.81 36.34,27.81 LED6.A2 LED7.A2 45.1,25.53 47.39,27.81 49.04,27.81 LED8.A2 51.45,25.4 51.45,16.76 51.71,16.51 v53.87,16.51
  Bottom 0.305: v53.87,16.51 65.17,16.51 68.34,13.34 98.19,13.34 101.49,16.64 104.67,16.64 SRCA2.1
SRCB1
  Top 0.305: LED9.A1 58.82,29.46 64.03,29.46 | 64.03,29.46 70.38,29.46 | 70.38,29.46 76.73,29.46 | 76.73,29.46 83.08,29.46 | 83.08,29.46 89.43,29.46 | 89.43,29.46 95.78,29.46 | 95.78,29.46 102.13,29.46 | 102.13,29.46 105.43,29.46 105.94,28.96 SRCB1.1 | LED15.A1 95.78,29.46 | LED14.A1 89.43,29.46 | LED13.A1 83.08,29.46 | LED12.A1 76.73,29.46 | LED11.A1 70.38,29.46 | LED10.A1 64.03,29.46 | LED16.A1 102.13,29.46
SRCB2
  Top 0.305: LED9.A2 59.96,27.81 61.74,27.81 LED10.A2 LED11.A2 LED12.A2 LED13.A2 84.73,27.18 87.78,27.18 LED14.A2 LED15.A2 LED16.A2 103.4,24.26 SRCB2.1